# Altium schematic sheet ModuleESP32Devkit1_CH340.SchDoc
size A4; SheetNumber: 1; SheetTotal: 1
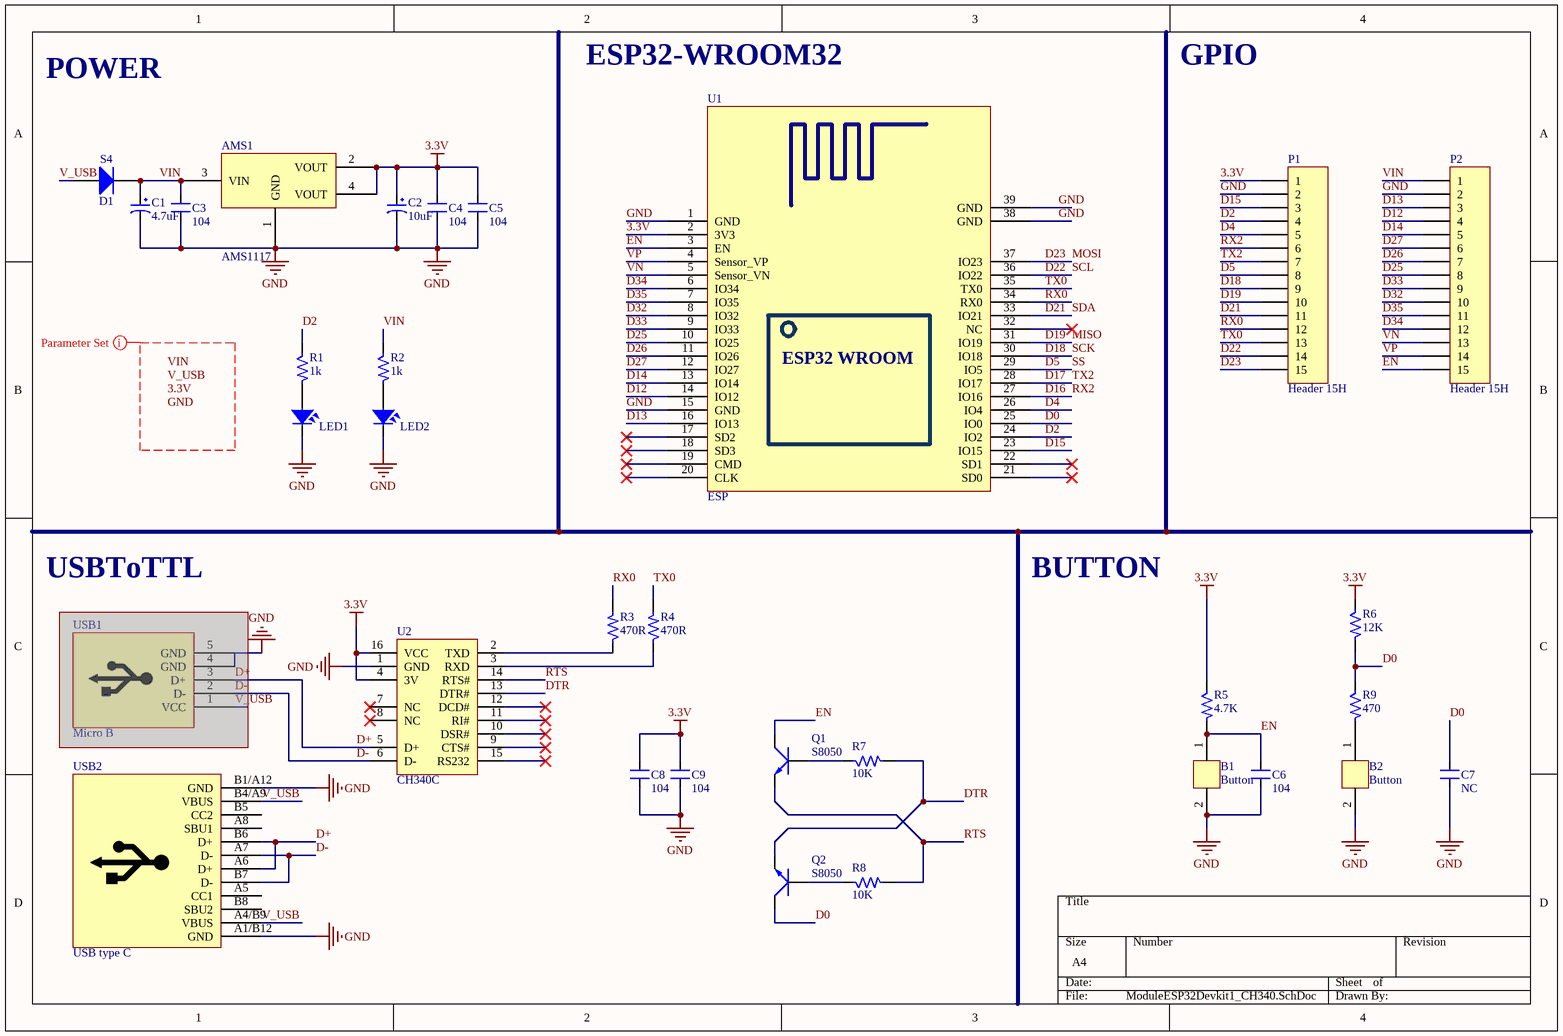
[diagram p0: ModuleESP32Devkit1_CH340.SchDoc]

## Parts
AMS1  AMS1117  [SOT223-4N]
B1  Button  [BUTTON 2P 3X4X2MM]
B2  Button  [BUTTON 2P 3X4X2MM]
C1  4.7uF  [C_Tanta_3216 - Black]
C2  10uF  [C_Tanta_3216 - Black]
C3  104  [CN-SMD-0603]
C4  104  [CN-SMD-0603]
C5  104  [CN-SMD-0603]
C6  104  [CN-SMD-0603]
C7  NC  [CN-SMD-0603]
C8  104  [CN-SMD-0603]
C9  104  [CN-SMD-0603]
D1  S4  [DIO-SMD-123]
LED1  LED SMD  [LED-0805-Green]  (value not drawn)
LED2  LED SMD  [LED-0805-Green]  (value not drawn)
P1  Header 15H  [Jump 1x15 - 2.54]
P2  Header 15H  [Jump 1x15 - 2.54]
Q1  S8050  [SOT23B]
Q2  S8050  [SOT23B]
R1  1k  [RES-SMD-0603]
R2  1k  [RES-SMD-0603]
R3  470R  [RES-SMD-0603]
R4  470R  [RES-SMD-0603]
R5  4.7K  [RES-SMD-0603]
R6  12K  [RES-SMD-0603]
R7  10K  [RES-SMD-0603]
R8  10K  [RES-SMD-0603]
R9  470  [RES-SMD-0603]
U1  ESP  [ESP32 WROOM]
U2  CH340C  [SO16]
USB1  Micro B  [micro USB MK5P]  (masked out: inside a compile mask, not in the netlist)
USB2  USB type C  [USB 16P type C]

## Nets
3.3V: AMS1.2(VOUT) AMS1.4(VOUT) C2.1 C4.2 C5.2 C8.2 C9.2 P1.1 R5.1 R6.1 U1.2(3V3) U2.4(3V) U2.16(VCC)
GND: AMS1.1(GND) B1.2 B2.2 C1.2 C2.2 C3.1 C4.1 C5.1 C6.1 C7.1 C8.1 C9.1 LED1.2 LED2.2 P1.2 P2.2 U1.1(GND) U1.15(GND) U1.38(GND) U1.39(GND) U2.1(GND) USB2.A1/B12(GND) USB2.B1/A12(GND)
D0: C7.2 Q2.2(C) R6.2 R9.1 U1.25(IO0)
D2: P1.4 R1.1 U1.24(IO2)
D4: P1.5 U1.26(IO4)
D5: P1.8 U1.29(IO5)  [also labelled SS]
D12: P2.4 U1.14(IO12)
D13: P2.3 U1.16(IO13)
D14: P2.5 U1.13(IO14)
D15: P1.3 U1.23(IO15)
D16: P1.6 U1.27(IO16)  [also labelled RX2]
D17: P1.7 U1.28(IO17)  [also labelled TX2]
D18: P1.9 U1.30(IO18)  [also labelled SCK]
D19: P1.10 U1.31(IO19)  [also labelled MISO]
D21: P1.11 U1.33(IO21)  [also labelled SDA]
D22: P1.14 U1.36(IO22)  [also labelled SCL]
D23: P1.15 U1.37(IO23)  [also labelled MOSI]
D25: P2.8 U1.10(IO25)
D26: P2.7 U1.11(IO26)
D27: P2.6 U1.12(IO27)
D32: P2.10 U1.8(IO32)
D33: P2.9 U1.9(IO33)
D34: P2.12 U1.6(IO34)
D35: P2.11 U1.7(IO35)
D+: U2.5(D+) USB2.A6(D+) USB2.B6(D+)
D-: U2.6(D-) USB2.A7(D-) USB2.B7(D-)
DTR: Q2.1(E) R7.2 U2.13(DTR#)
EN: B1.1 C6.2 P2.15 Q1.2(C) R5.2 U1.3(EN)
RTS: Q1.1(E) R8.2 U2.14(RTS#)
RX0: P1.12 R3.2 U1.34(RX0)
TX0: P1.13 R4.2 U1.35(TX0)
V_USB: D1.1(A) USB2.A4/B9(VBUS) USB2.B4/A9(VBUS)
VIN: AMS1.3(VIN) C1.1 C3.2 D1.2(K) P2.1 R2.1
VN: P2.13 U1.5(Sensor_VN)
VP: P2.14 U1.4(Sensor_VP)
NetB2_1: B2.1 R9.2
NetLED1_1: LED1.1 R1.2
NetLED2_1: LED2.1 R2.2
NetQ1_3: Q1.3(B) R7.1
NetQ2_3: Q2.3(B) R8.1
NetR3_1: R3.1 U2.2(TXD)
NetR4_1: R4.1 U2.3(RXD)

Not connected (* = marked no-connect by the designer): U1 17(SD2)* 18(SD3)* 19(CMD)* 20(CLK)* 21(SD0)* 22(SD1)* 32(NC)*; U2 7(NC)* 8(NC)* 9(CTS#)* 10(DSR#)* 11(RI#)* 12(DCD#)* 15(RS232)*; USB2 A5(CC1) A8(SBU1) B5(CC2) B8(SBU2)

## Layout directives
net class POWER: 3.3V, GND, V_USB, VIN

## Notes on the sheet
- POWER
- ESP32-WROOM32
- GPIO
- USBToTTL
- BUTTON
- Labels drawn without touching a wire or pin: 3.3V, GND, V_USB, VIN
- (in symbol ESP 32 WROOM) ESP32 WROOM

## Library data of the parts
AMS1 = AMS1117: AMS
B1 B2 = Button 2 Pin
C1 C2 = CP-MKB: Value: 10uF/50V; Description 1: 10 => 220uF/6,3V/10V - 10uF => 100uF/16V; Description 2: 0,1uF => 33uF/50V - 10uF => 22uF/63V; Description 3: 0,47uF => 10uF/100V
C3-C9 = CAP-MKB: Cap SMD; Value: 103
D1 = Diode: Default Diode; Code - JEDEC: DO-214-AB; Value: 1N5007; Published: 8-Jun-2000; Revision: July-2002: Re-released for DXP Platform.; Publisher: Altium Limited
LED1 LED2 = LED - MKB
P1 P2 = Header 15H: Header, 15-Pin, Right Angle; LatestRevisionDate: 17-Jul-2002; LatestRevisionNote: Re-released for DXP Platform.; Publisher: Altium Limited
Q1 = Trans NPN_2: Transistor dán
Q2 = Trans NPN_1: Transistor dán
R1-R9 = RES - MKB: Resistor 1/4W; Value: R1/4W - 1K
U1 = ESP 32 WROOM: ESP32
U2 = CH340C: High and Low Side Driver; Note: Pins 4, 8 and 14 are not connected; Published: 8-Jun-2000; LatestRevisionDate: 04-Mar-2005; LatestRevisionNote: Stylized 3D Model Added.; DatasheetVersion: PD60147J; PackageReference: PDIP14; Publisher: Altium Limited; PackageDescription: DIP; 14 Leads; Row Spacing 7.62 mm; Pitch 2.54 mm; ComponentLink1Description: Manufacturer Link; ComponentLink1URL: http://www.irf.com/; ComponentLink2Description: Datasheet; ComponentLink2URL: http://www.irf.com/product-info/datasheets/data/ir2110.pdf
USB1 = USB - Micro B
USB2 = USB C 16P: Type C